# Altium schematic sheet SCH_L2-P2.3.SchDoc: PCB_Project_WNDCVX1X_CONTROL_BOARD
size A3; DrawnBy: Raihan Bin Mofidul; Organization: Walton Hi-Tech Industries Ltd.; DocumentNumber: 1; Revision: 1; SheetNumber: 1; SheetTotal: 1
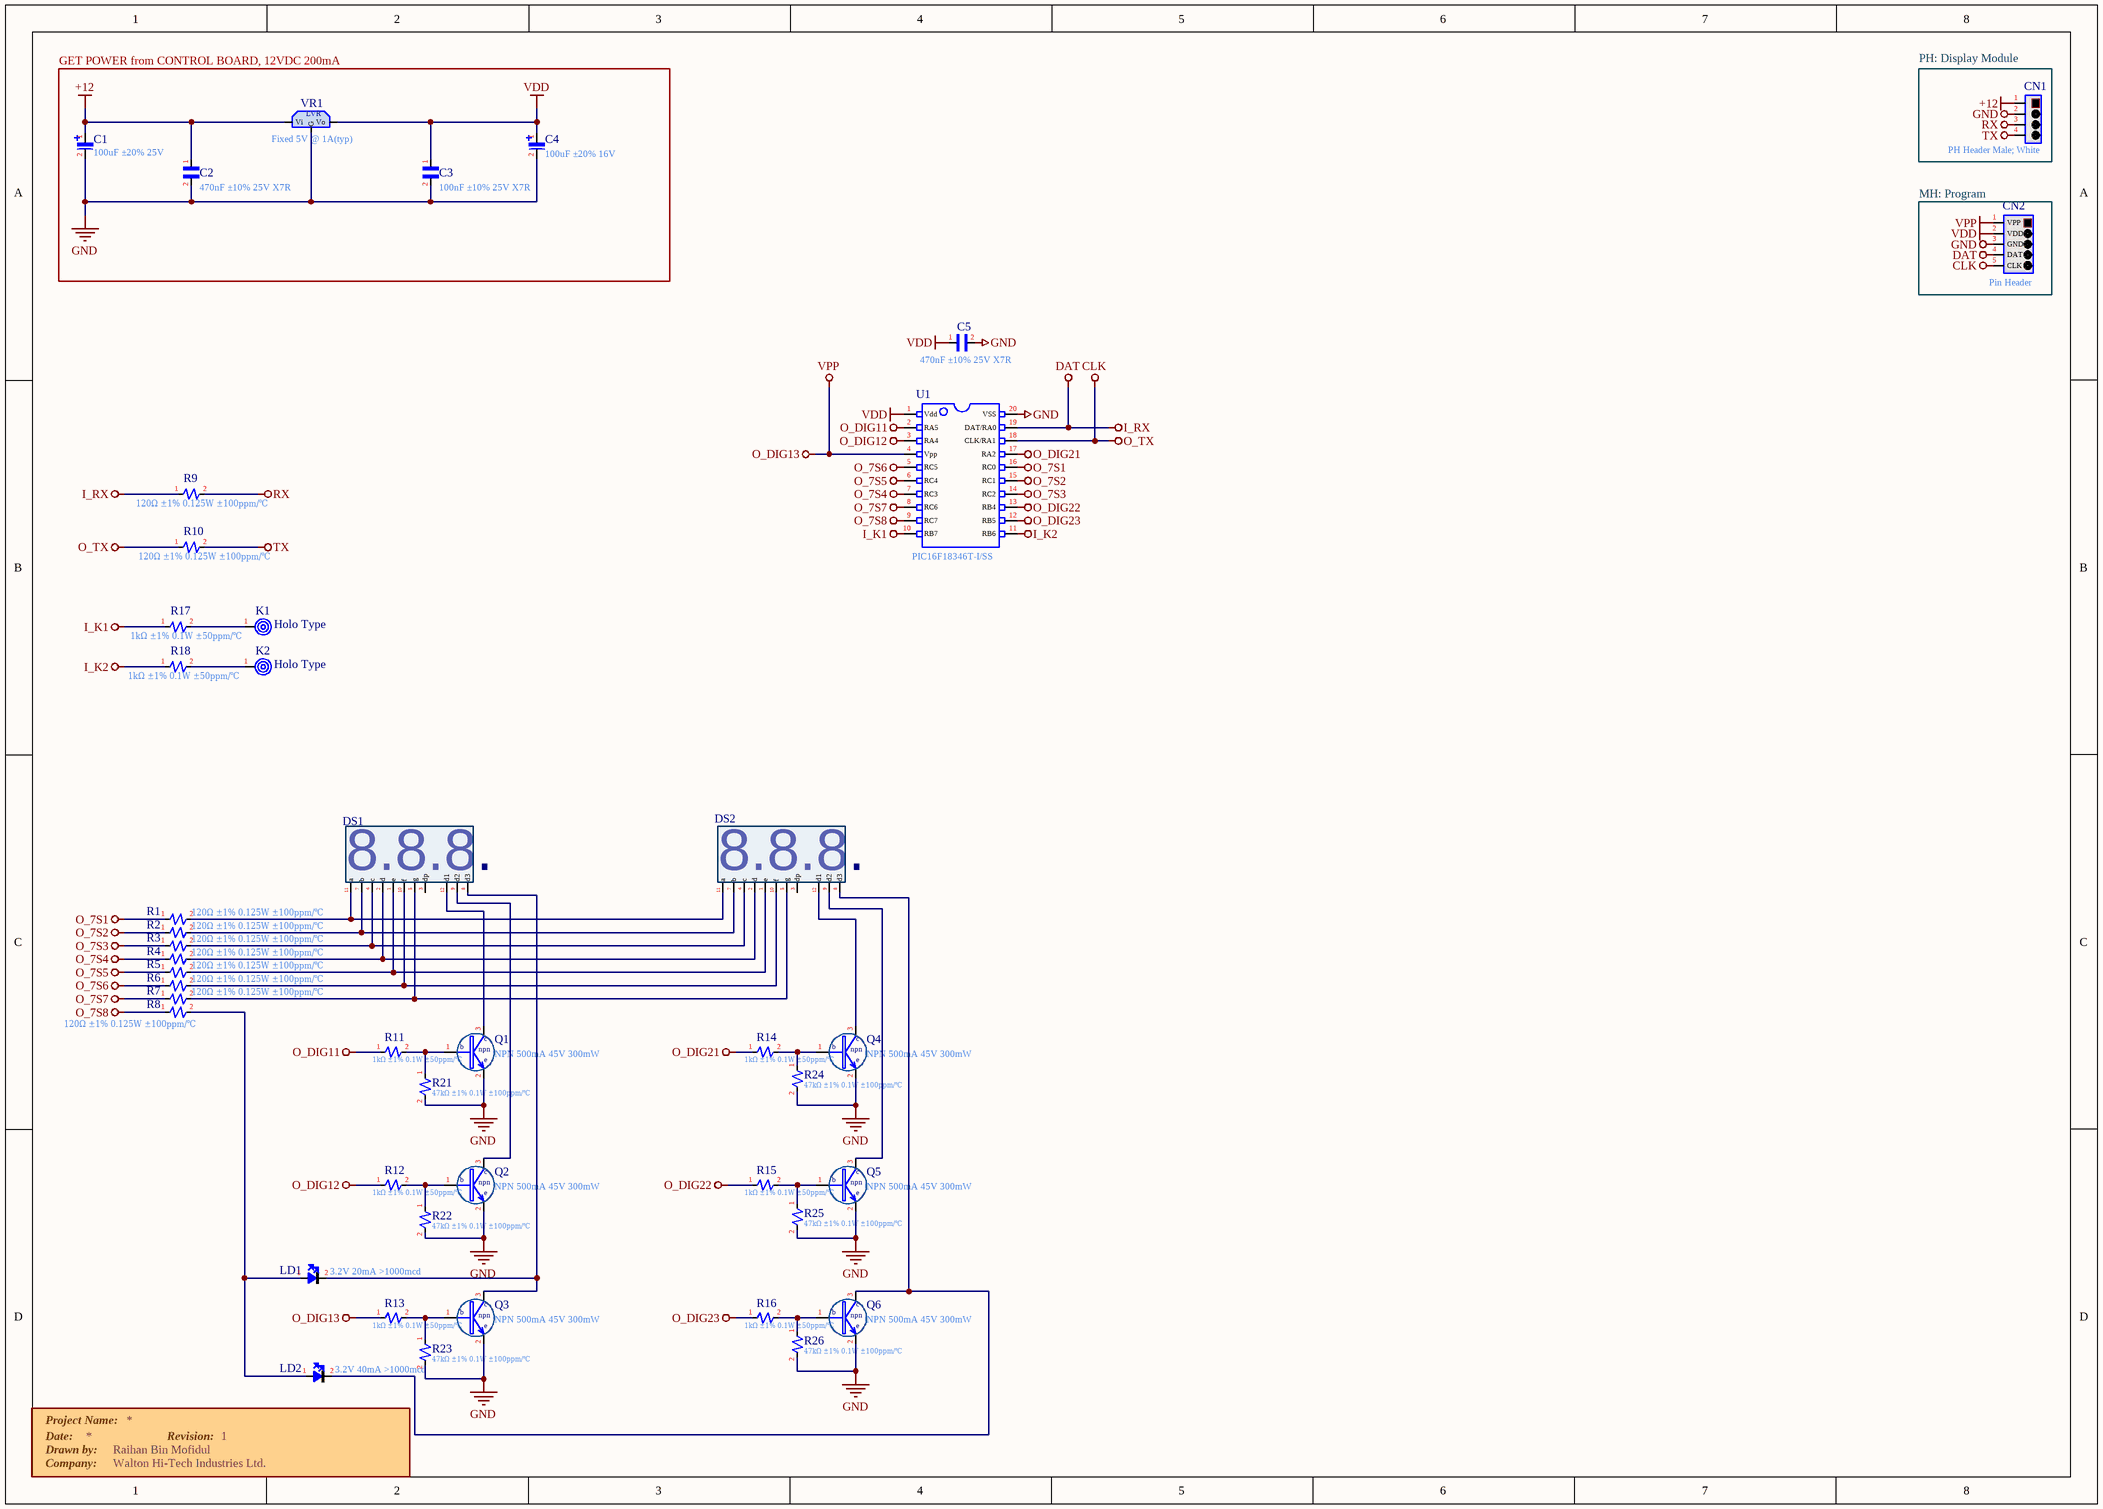
[diagram p0: SCH_L2-P2.3.SchDoc]

## Parts
C1  100uF ±20% 25V  [C_SMD_Ø6.3*5.4mm]
C2  470nF ±10% 25V X7R  [C_0603]
C3  100nF ±10% 25V X7R  [C_0603]
C4  100uF ±20% 16V  [C_SMD_Ø6.3*5.4mm]
C5  470nF ±10% 25V X7R  [C_0603]
CN1  PH Header Male; White  [CN_4P_A2001WR-S-XP-LCP]
CN2  Pin Header  [CN_PIC_MCU_Debugger_RightAngle]
DS1  Display>> 7Seg 3Dig  [DS_0.36"_3DIG]  (value not drawn)
DS2  Display>> 7Seg 3Dig  [DS_0.36"_3DIG]  (value not drawn)
K1  Holo Type  [K_Cap-Touch-Square_LED]
K2  Holo Type  [K_Cap-Touch-Square_LED]
LD1  3.2V 20mA >1000mcd  [LED_4.8x5.8_P2.54]
LD2  3.2V 40mA >1000mcd  [LED_4.8x5.8_P2.54]
Q1  NPN 500mA 45V 300mW  [Q_SOT-23_NPN]
Q2  NPN 500mA 45V 300mW  [Q_SOT-23_NPN]
Q3  NPN 500mA 45V 300mW  [Q_SOT-23_NPN]
Q4  NPN 500mA 45V 300mW  [Q_SOT-23_NPN]
Q5  NPN 500mA 45V 300mW  [Q_SOT-23_NPN]
Q6  NPN 500mA 45V 300mW  [Q_SOT-23_NPN]
R1  120Ω ±1% 0.125W ±100ppm/℃  [R_0603]
R2  120Ω ±1% 0.125W ±100ppm/℃  [R_0603]
R3  120Ω ±1% 0.125W ±100ppm/℃  [R_0603]
R4  120Ω ±1% 0.125W ±100ppm/℃  [R_0603]
R5  120Ω ±1% 0.125W ±100ppm/℃  [R_0603]
R6  120Ω ±1% 0.125W ±100ppm/℃  [R_0603]
R7  120Ω ±1% 0.125W ±100ppm/℃  [R_0603]
R8  120Ω ±1% 0.125W ±100ppm/℃  [R_0603]
R9  120Ω ±1% 0.125W ±100ppm/℃  [R_0603]
R10  120Ω ±1% 0.125W ±100ppm/℃  [R_0603]
R11  1kΩ ±1% 0.1W ±50ppm/℃  [R_0603]
R12  1kΩ ±1% 0.1W ±50ppm/℃  [R_0603]
R13  1kΩ ±1% 0.1W ±50ppm/℃  [R_0603]
R14  1kΩ ±1% 0.1W ±50ppm/℃  [R_0603]
R15  1kΩ ±1% 0.1W ±50ppm/℃  [R_0603]
R16  1kΩ ±1% 0.1W ±50ppm/℃  [R_0603]
R17  1kΩ ±1% 0.1W ±50ppm/℃  [R_0603]
R18  1kΩ ±1% 0.1W ±50ppm/℃  [R_0603]
R21  47kΩ ±1% 0.1W ±100ppm/℃  [R_0603]
R22  47kΩ ±1% 0.1W ±100ppm/℃  [R_0603]
R23  47kΩ ±1% 0.1W ±100ppm/℃  [R_0603]
R24  47kΩ ±1% 0.1W ±100ppm/℃  [R_0603]
R25  47kΩ ±1% 0.1W ±100ppm/℃  [R_0603]
R26  47kΩ ±1% 0.1W ±100ppm/℃  [R_0603]
U1  PIC16F18346T-I/SS  [U_PIC_20pin_SSOP]
VR1  Fixed 5V @ 1A(typ)  [VR_TO-252-2(DPAK)]

## Blocks framed on the sheet
GET POWER from CONTROL BOARD, 12VDC 200mA: C1-C4 VR1
PH: Display Module: CN1
MH: Program: CN2

## Nets
+12: C1.1 C2.1 CN1.1 VR1.V-IN(Vi)
CLK: CN2.5(CLK) R10.1 U1.18(CLK/RA1)  [also labelled O_TX]
DAT: CN2.4(DAT) R9.1 U1.19(DAT/RA0)  [also labelled I_RX]
GND: C1.2 C2.2 C3.2 C4.2 C5.2 CN1.2 CN2.3(GND) Q1.2(Emitter) Q2.2(Emitter) Q3.2(Emitter) Q4.2(Emitter) Q5.2(Emitter) Q6.2(Emitter) R21.2 R22.2 R23.2 R24.2 R25.2 R26.2 U1.20(VSS) VR1.GND(G)
I_K1: R17.1 U1.10(RB7)
I_K2: R18.1 U1.11(RB6)
O_7S1: R1.1 U1.16(RC0)
O_7S2: R2.1 U1.15(RC1)
O_7S3: R3.1 U1.14(RC2)
O_7S4: R4.1 U1.7(RC3)
O_7S5: R5.1 U1.6(RC4)
O_7S6: R6.1 U1.5(RC5)
O_7S7: R7.1 U1.8(RC6)
O_7S8: R8.1 U1.9(RC7)
O_DIG11: R11.1 U1.2(RA5)
O_DIG12: R12.1 U1.3(RA4)
O_DIG13: CN2.1(VPP) R13.1 U1.4(Vpp)  [also labelled VPP]
O_DIG21: R14.1 U1.17(RA2)
O_DIG22: R15.1 U1.13(RB4)
O_DIG23: R16.1 U1.12(RB5)
RX: CN1.3 R9.2
TX: CN1.4 R10.2
VDD: C3.1 C4.1 C5.1 CN2.2(VDD) U1.1(Vdd) VR1.V-OUT(Vo)
NetDS1_1: DS1.1(e) DS2.1(e) R5.2
NetDS1_2: DS1.2(d) DS2.2(d) R4.2
NetDS1_4: DS1.4(c) DS2.4(c) R3.2
NetDS1_5: DS1.5(g) DS2.5(g) R7.2
NetDS1_7: DS1.7(b) DS2.7(b) R2.2
NetDS1_8: DS1.8(d3) LD1.2(vss) Q3.3(Collector)
NetDS1_9: DS1.9(d2) Q2.3(Collector)
NetDS1_10: DS1.10(f) DS2.10(f) R6.2
NetDS1_11: DS1.11(a) DS2.11(a) R1.2
NetDS1_12: DS1.12(d1) Q1.3(Collector)
NetDS2_8: DS2.8(d3) LD2.2(vss) Q6.3(Collector)
NetDS2_9: DS2.9(d2) Q5.3(Collector)
NetDS2_12: DS2.12(d1) Q4.3(Collector)
NetK1_1: K1.1 R17.2
NetK2_1: K2.1 R18.2
NetLD1_1: LD1.1(vdd) LD2.1(vdd) R8.2
NetQ1_1: Q1.1(Base) R11.2 R21.1
NetQ2_1: Q2.1(Base) R12.2 R22.1
NetQ3_1: Q3.1(Base) R13.2 R23.1
NetQ4_1: Q4.1(Base) R14.2 R24.1
NetQ5_1: Q5.1(Base) R15.2 R25.1
NetQ6_1: Q6.1(Base) R16.2 R26.1

Not connected (* = marked no-connect by the designer): DS1 3(dp); DS2 3(dp)

## Notes on the sheet
- Project Name:
- Date:
- Drawn by:
- Revision:
- Company:
- Title
- Size:
- A4
- Number:
- Time:
- Sheet
- of
- File:
- (in symbol Display>> 7Seg 3Dig) 8.8.8.
- (in symbol Transistor>> BJT npn) c; b; npn; e
- (in symbol Voltage Regulator) LVR

## Library data of the parts
C1 C4 = Capacitor>> Polar: SMD,6.3x5.4mm Aluminum Electrolytic Capacitors - SMD RoHS
C2 C3 C5 = Capacitor>> Non-Polar: 0603 Multilayer Ceramic Capacitors MLCC - SMD/SMT RoHS
CN1 = Connector>> 4Pins: A2001WR-S-4P; Pin 0.079"(2.00mm) 4 SMD,P=2mm Wire To Board / Wire To Wire Connector RoHS
CN2 = Connector>> PIC Program: A2541WR-5P/MTB125-1105R1/PZ254R-11-05P ;5pins, right-angle 90degrees 2.54mm Through Hole,P=2.54mm Pin Header & Female Header RoHS
K1 K2 = Key>> Cap Touch
LD1 LD2 = LED>> General Purpose
Q1-Q6 = Transistor>> BJT npn: BC817-40; SOT-23(SOT-23-3) Transistors (NPN/PNP) RoHS
R1-R10 = Resistor>> General Purpose: RK73H1JTTD1200F; 0603 Chip Resistor - Surface Mount RoHS
R11-R18 = Resistor>> General Purpose: RK73G1JTTD1001F; 0603 Chip Resistor - Surface Mount RoHS
R21-R26 = Resistor>> General Purpose: RK73H1JTTD4702F; 0603 Chip Resistor - Surface Mount RoHS
U1 = IC>> PIC 20Pins: Lead Count: 20 / Package Type: SSOP / Temp Range: -40C to +85C / Packing Media: Tape and reel (1600)
VR1 = Voltage Regulator: CJ78D05/MC7805BDTRKG; TO-252-2(DPAK) Dropout Regulators(LDO) RoHS